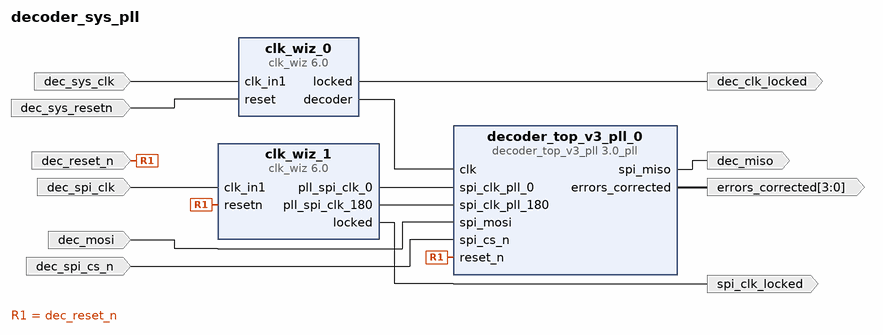
[diagram p0: block diagram of the top level]
# Vivado block design decoder_sys_pll, xc7z020clg484-1, Vivado 2022.1
create_bd_design decoder_sys_pll

create_bd_port -dir O -type data dec_clk_locked
create_bd_port -dir O -type data dec_miso
create_bd_port -dir I -type data dec_mosi
create_bd_port -dir I -type rst dec_reset_n
create_bd_port -dir I -type clk dec_spi_clk
set_property -dict {CONFIG.FREQ_HZ 50000000} [get_bd_ports dec_spi_clk]
create_bd_port -dir I -type data dec_spi_cs_n
create_bd_port -dir I -type clk dec_sys_clk
set_property -dict {CONFIG.FREQ_HZ 100000000} [get_bd_ports dec_sys_clk]
create_bd_port -dir I -type rst dec_sys_resetn
set_property -dict {CONFIG.POLARITY ACTIVE_HIGH} [get_bd_ports dec_sys_resetn]
create_bd_port -dir O -from 3 -to 0 -type data errors_corrected
create_bd_port -dir O -type data spi_clk_locked

create_bd_cell -type ip -vlnv xilinx.com:ip:clk_wiz:6.0 clk_wiz_0
set_property -dict [list \
  CONFIG.CLKOUT2_JITTER 175.402 \
  CONFIG.CLKOUT2_PHASE_ERROR 98.575 \
  CONFIG.CLKOUT2_REQUESTED_OUT_FREQ 100.000 \
  CONFIG.CLKOUT2_USED false \
  CONFIG.CLKOUT3_JITTER 175.402 \
  CONFIG.CLKOUT3_PHASE_ERROR 98.575 \
  CONFIG.CLKOUT3_REQUESTED_OUT_FREQ 100.000 \
  CONFIG.CLKOUT3_REQUESTED_PHASE 0.000 \
  CONFIG.CLKOUT3_USED false \
  CONFIG.CLK_OUT1_PORT decoder \
  CONFIG.CLK_OUT2_PORT clk_out2 \
  CONFIG.CLK_OUT3_PORT clk_out3 \
  CONFIG.MMCM_CLKOUT1_DIVIDE 1 \
  CONFIG.MMCM_CLKOUT2_DIVIDE 1 \
  CONFIG.MMCM_CLKOUT2_PHASE 0.000 \
  CONFIG.NUM_OUT_CLKS 1 \
  CONFIG.PRIM_IN_FREQ 100.000 \
  CONFIG.RESET_PORT reset \
  CONFIG.RESET_TYPE ACTIVE_HIGH \
] [get_bd_cells clk_wiz_0]
create_bd_cell -type ip -vlnv xilinx.com:ip:clk_wiz:6.0 clk_wiz_1
set_property -dict [list \
  CONFIG.CLKIN1_JITTER_PS 200.0 \
  CONFIG.CLKOUT1_DRIVES BUFG \
  CONFIG.CLKOUT1_JITTER 386.663 \
  CONFIG.CLKOUT1_PHASE_ERROR 261.747 \
  CONFIG.CLKOUT1_REQUESTED_OUT_FREQ 25.000 \
  CONFIG.CLKOUT2_DRIVES BUFG \
  CONFIG.CLKOUT2_JITTER 386.663 \
  CONFIG.CLKOUT2_PHASE_ERROR 261.747 \
  CONFIG.CLKOUT2_REQUESTED_OUT_FREQ 25.000 \
  CONFIG.CLKOUT2_REQUESTED_PHASE 180.000 \
  CONFIG.CLKOUT2_USED true \
  CONFIG.CLKOUT3_DRIVES BUFG \
  CONFIG.CLKOUT4_DRIVES BUFG \
  CONFIG.CLKOUT5_DRIVES BUFG \
  CONFIG.CLKOUT6_DRIVES BUFG \
  CONFIG.CLKOUT7_DRIVES BUFG \
  CONFIG.CLK_OUT1_PORT pll_spi_clk_0 \
  CONFIG.CLK_OUT2_PORT pll_spi_clk_180 \
  CONFIG.FEEDBACK_SOURCE FDBK_AUTO \
  CONFIG.MMCM_BANDWIDTH OPTIMIZED \
  CONFIG.MMCM_CLKFBOUT_MULT_F 33 \
  CONFIG.MMCM_CLKIN1_PERIOD 20.000 \
  CONFIG.MMCM_CLKIN2_PERIOD 10.0 \
  CONFIG.MMCM_CLKOUT0_DIVIDE_F 33 \
  CONFIG.MMCM_CLKOUT1_DIVIDE 33 \
  CONFIG.MMCM_CLKOUT1_PHASE 180.000 \
  CONFIG.MMCM_COMPENSATION ZHOLD \
  CONFIG.MMCM_DIVCLK_DIVIDE 2 \
  CONFIG.NUM_OUT_CLKS 2 \
  CONFIG.PLL_CLKIN_PERIOD 20.000 \
  CONFIG.PRIMITIVE PLL \
  CONFIG.PRIM_IN_FREQ 50.000 \
  CONFIG.RESET_PORT resetn \
  CONFIG.RESET_TYPE ACTIVE_LOW \
] [get_bd_cells clk_wiz_1]
create_bd_cell -type ip -vlnv xilinx.com:user:decoder_top_v3_pll:3.0_pll decoder_top_v3_pll_0

# ---- connections ----

connect_bd_net [get_bd_ports dec_reset_n] [get_bd_pins clk_wiz_1/resetn] [get_bd_pins decoder_top_v3_pll_0/reset_n]
connect_bd_net [get_bd_pins clk_wiz_0/decoder] [get_bd_pins decoder_top_v3_pll_0/clk]
connect_bd_net [get_bd_pins clk_wiz_0/locked] [get_bd_ports dec_clk_locked]
connect_bd_net [get_bd_pins clk_wiz_1/locked] [get_bd_ports spi_clk_locked]
connect_bd_net [get_bd_pins clk_wiz_1/pll_spi_clk_0] [get_bd_pins decoder_top_v3_pll_0/spi_clk_pll_0]
connect_bd_net [get_bd_pins clk_wiz_1/pll_spi_clk_180] [get_bd_pins decoder_top_v3_pll_0/spi_clk_pll_180]
connect_bd_net [get_bd_ports dec_mosi] [get_bd_pins decoder_top_v3_pll_0/spi_mosi]
connect_bd_net [get_bd_ports dec_spi_clk] [get_bd_pins clk_wiz_1/clk_in1]
connect_bd_net [get_bd_ports dec_spi_cs_n] [get_bd_pins decoder_top_v3_pll_0/spi_cs_n]
connect_bd_net [get_bd_ports dec_sys_clk] [get_bd_pins clk_wiz_0/clk_in1]
connect_bd_net [get_bd_ports dec_sys_resetn] [get_bd_pins clk_wiz_0/reset]
connect_bd_net [get_bd_pins decoder_top_v3_pll_0/errors_corrected] [get_bd_ports errors_corrected]
connect_bd_net [get_bd_pins decoder_top_v3_pll_0/spi_miso] [get_bd_ports dec_miso]

validate_bd_design
save_bd_design
